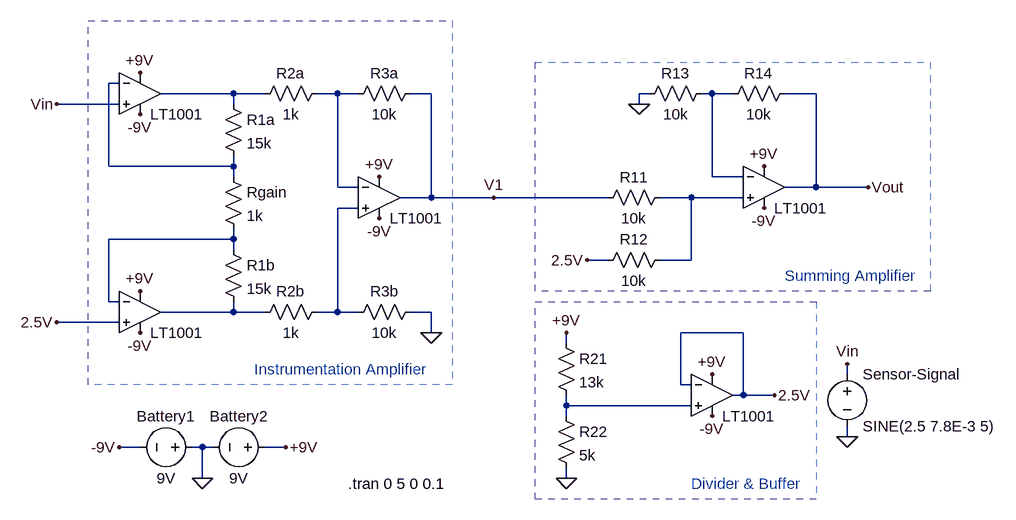
[diagram p0: schematic 2012 Q2.asc]
2012 Q2.asc, the LTspice schematic file:
Version 4
SHEET 1 880 712
WIRE -896 0 -912 0
WIRE -720 16 -832 16
WIRE -672 16 -720 16
WIRE -560 16 -592 16
WIRE -528 16 -560 16
WIRE -416 16 -448 16
WIRE -80 16 -96 16
WIRE 16 16 0 16
WIRE 48 16 16 16
WIRE 176 16 128 16
WIRE -896 32 -992 32
WIRE -720 32 -720 16
WIRE -96 32 -96 16
WIRE -912 128 -912 0
WIRE -720 128 -720 112
WIRE -720 128 -912 128
WIRE -720 144 -720 128
WIRE 16 144 16 16
WIRE 64 144 16 144
WIRE -560 160 -560 16
WIRE -528 160 -560 160
WIRE 176 160 176 16
WIRE 176 160 128 160
WIRE 256 160 176 160
WIRE -416 176 -416 16
WIRE -416 176 -464 176
WIRE -320 176 -416 176
WIRE -144 176 -320 176
WIRE -16 176 -64 176
WIRE 64 176 -16 176
WIRE -528 192 -560 192
WIRE -720 240 -720 224
WIRE -720 240 -912 240
WIRE -720 256 -720 240
WIRE -144 272 -176 272
WIRE -16 272 -16 176
WIRE -16 272 -64 272
WIRE -912 336 -912 240
WIRE -896 336 -912 336
WIRE -720 352 -720 336
WIRE -720 352 -832 352
WIRE -672 352 -720 352
WIRE -560 352 -560 192
WIRE -560 352 -592 352
WIRE -528 352 -560 352
WIRE -416 352 -448 352
WIRE -896 368 -992 368
WIRE -416 384 -416 352
WIRE 64 384 -32 384
WIRE -208 400 -208 384
WIRE 224 448 224 432
WIRE -32 464 -32 384
WIRE -16 464 -32 464
WIRE 64 480 64 384
WIRE 64 480 48 480
WIRE 112 480 64 480
WIRE -208 496 -208 480
WIRE -16 496 -208 496
WIRE -208 512 -208 496
WIRE 224 544 224 528
WIRE -864 560 -896 560
WIRE -768 560 -784 560
WIRE -752 560 -768 560
WIRE -640 560 -672 560
WIRE -768 608 -768 560
WIRE -208 608 -208 592
FLAG -416 384 0
FLAG -208 608 0
FLAG 112 480 2.5V
FLAG -176 272 2.5V
FLAG -96 32 0
FLAG -320 176 V1
FLAG 256 160 Vout
FLAG -992 368 2.5V
FLAG -992 32 Vin
FLAG -208 384 +9V
FLAG -864 -16 +9V
FLAG -864 320 +9V
FLAG -496 144 +9V
FLAG 96 128 +9V
FLAG 16 448 +9V
FLAG -864 48 -9V
FLAG -864 384 -9V
FLAG 16 512 -9V
FLAG 96 192 -9V
FLAG -496 208 -9V
FLAG -768 608 0
FLAG -896 560 -9V
FLAG -640 560 +9V
FLAG 224 432 Vin
FLAG 224 544 0
SYMBOL res -736 16 R0
SYMATTR InstName R1a
SYMATTR Value 15k
SYMBOL res -736 128 R0
SYMATTR InstName Rgain
SYMATTR Value 1k
SYMBOL res -736 240 R0
SYMATTR InstName R1b
SYMATTR Value 15k
SYMBOL res -432 0 R90
WINDOW 0 0 56 VBottom 2
WINDOW 3 32 56 VTop 2
SYMATTR InstName R3a
SYMATTR Value 10k
SYMBOL res -432 336 R90
WINDOW 0 0 56 VBottom 2
WINDOW 3 32 56 VTop 2
SYMATTR InstName R3b
SYMATTR Value 10k
SYMBOL res -576 0 R90
WINDOW 0 0 56 VBottom 2
WINDOW 3 32 56 VTop 2
SYMATTR InstName R2a
SYMATTR Value 1k
SYMBOL res -576 336 R90
WINDOW 0 0 56 VBottom 2
WINDOW 3 32 56 VTop 2
SYMATTR InstName R2b
SYMATTR Value 1k
SYMBOL LT1001 -864 -48 R0
WINDOW 0 16 32 Invisible 2
SYMATTR InstName U1
SYMBOL LT1001 -864 288 R0
WINDOW 0 16 32 Invisible 2
SYMATTR InstName U2
SYMBOL LT1001 -496 112 R0
WINDOW 0 16 32 Invisible 2
SYMATTR InstName U3
SYMBOL res -224 384 R0
SYMATTR InstName R21
SYMATTR Value 13k
SYMBOL res -224 496 R0
SYMATTR InstName R22
SYMATTR Value 5k
SYMBOL LT1001 16 416 R0
WINDOW 0 16 32 Invisible 2
SYMATTR InstName U4
SYMBOL res -48 160 R90
WINDOW 0 0 56 VBottom 2
WINDOW 3 32 56 VTop 2
SYMATTR InstName R11
SYMATTR Value 10k
SYMBOL res -48 256 R90
WINDOW 0 0 56 VBottom 2
WINDOW 3 32 56 VTop 2
SYMATTR InstName R12
SYMATTR Value 10k
SYMBOL LT1001 96 96 R0
WINDOW 0 16 32 Invisible 2
SYMATTR InstName U5
SYMBOL res 16 0 R90
WINDOW 0 0 56 VBottom 2
WINDOW 3 32 56 VTop 2
SYMATTR InstName R13
SYMATTR Value 10k
SYMBOL res 144 0 R90
WINDOW 0 0 56 VBottom 2
WINDOW 3 32 56 VTop 2
SYMATTR InstName R14
SYMATTR Value 10k
SYMBOL voltage -656 560 R90
WINDOW 0 -32 56 VBottom 2
WINDOW 3 32 56 VTop 2
SYMATTR InstName Battery2
SYMATTR Value 9V
SYMBOL voltage -768 560 R90
WINDOW 0 -32 56 VBottom 2
WINDOW 3 32 56 VTop 2
SYMATTR InstName Battery1
SYMATTR Value 9V
SYMBOL voltage 224 432 R0
SYMATTR InstName Sensor-Signal
SYMATTR Value SINE(2.5 7.8E-3 5)
TEXT -688 440 Left 2 ;Instrumentation Amplifier
TEXT 128 296 Left 2 ;Summing Amplifier
TEXT -16 616 Left 2 ;Divider & Buffer
TEXT -544 616 Left 2 !.tran 0 5 0 0.1
RECTANGLE Normal -384 464 -944 -96 2
RECTANGLE Normal 176 640 -256 336 2
RECTANGLE Normal 352 320 -256 -32 2

The netlist it stands for:
* 2012 Q2.asc
R1a N002 N001 15k
Rgain N001 N007 1k
R1b N007 N008 15k
R3a V1 N003 10k
R3b 0 N006 10k
R2a N003 N002 1k
R2b N006 N008 1k
XU1 Vin N001 +9V -9V N002 LT1001  ; pins In+ In- V+ V- OUT
XU2 2.5V N007 +9V -9V N008 LT1001  ; pins In+ In- V+ V- OUT
XU3 N006 N003 +9V -9V V1 LT1001  ; pins In+ In- V+ V- OUT
R21 +9V N009 13k
R22 N009 0 5k
XU4 N009 2.5V +9V -9V 2.5V LT1001  ; pins In+ In- V+ V- OUT
R11 N005 V1 10k
R12 N005 2.5V 10k
XU5 N005 N004 +9V -9V Vout LT1001  ; pins In+ In- V+ V- OUT
R13 N004 0 10k
R14 Vout N004 10k
V§Battery2 +9V 0 9V
V§Battery1 0 -9V 9V
V§Sensor-Signal Vin 0 SINE(2.5 7.8E-3 5)
* Instrumentation Amplifier
* Summing Amplifier
* Divider & Buffer
.tran 0 5 0 0.1
.lib LTC.lib
.backanno
.end